# EAGLE design Čos v0.1 (EAGLE 9.6.2)
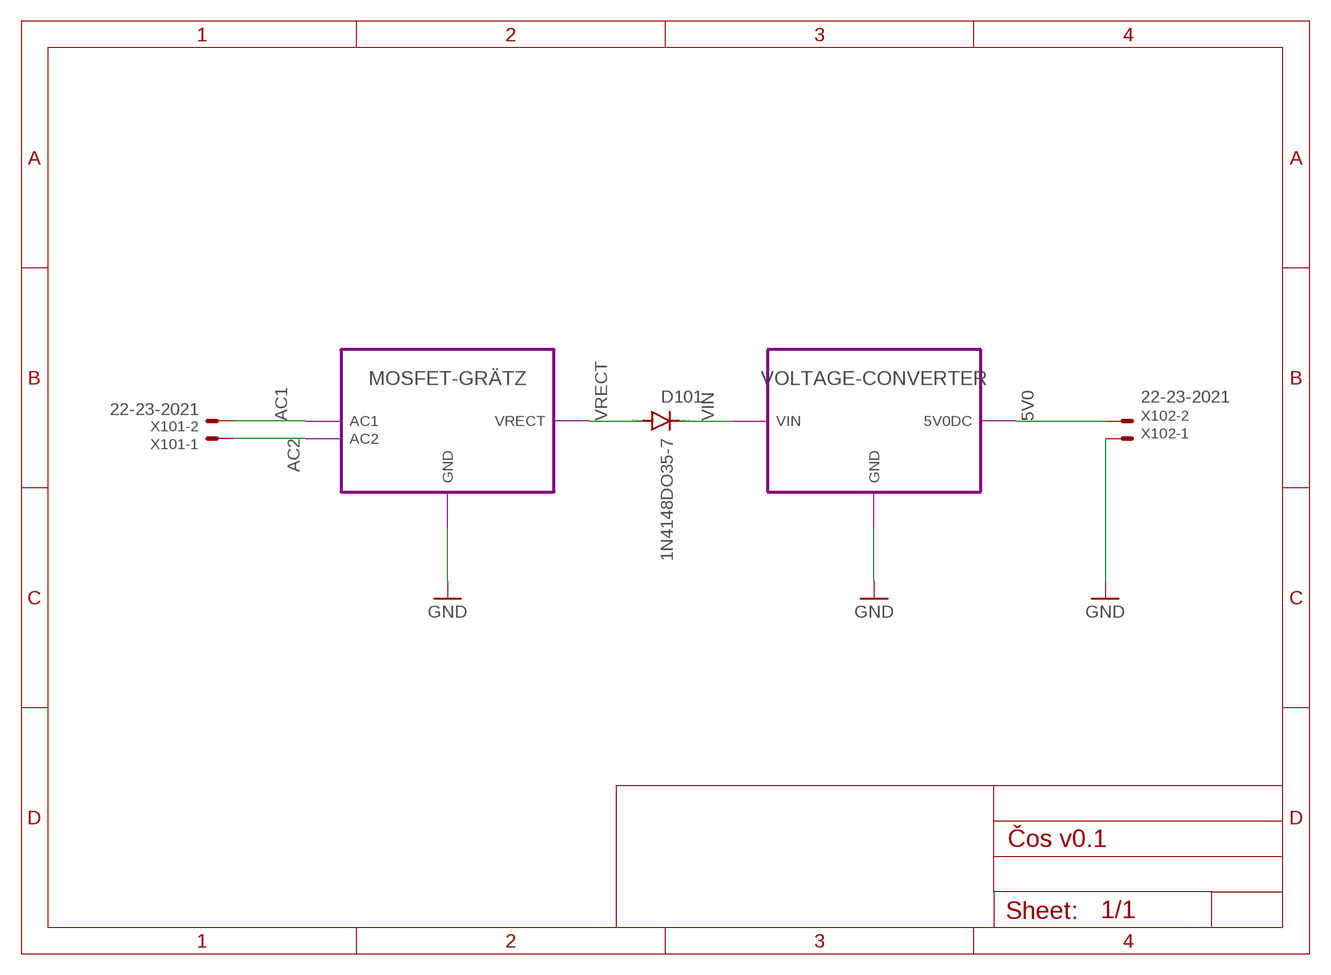
[diagram p0: schematic, sheet 1]

## Parts
D101  1N4148DO35-7  [DO35-7]
X101  22-23-2021  [22-23-2021]
X102  22-23-2021  [22-23-2021]

## Module instances
MOSFET-GRÄTZ = MOSFET-GRAETZ (part numbers offset by 200)
VOLTAGE-CONVERTER = VOLTAGE-CONVERTER (part numbers offset by 300)

## Nets
5V0 [voltage]: X102.2 ; port VOLTAGE-CONVERTER.5V0DC
AC1 [voltage]: X101.2 ; port MOSFET-GRÄTZ.AC1
AC2 [voltage]: X101.1 ; port MOSFET-GRÄTZ.AC2
GND [GND]: X102.1 ; port MOSFET-GRÄTZ.GND VOLTAGE-CONVERTER.GND
VIN [voltage]: D101.C ; port VOLTAGE-CONVERTER.VIN
VRECT [voltage]: D101.A ; port MOSFET-GRÄTZ.VRECT

## Library data of the parts
D101 = diode:1N4148: DIODE high speed (Philips)
X101 X102 = con-molex:22-23-2021: .100" (2.54mm) Center Header - 2 Pin; MF: MOLEX; MPN: 22-23-2021; OC_FARNELL: 1462926; OC_NEWARK: 25C3832

## Module MOSFET-GRAETZ
Ports: AC1(pwr) AC2(pwr) VRECT(pwr) GND(pwr)
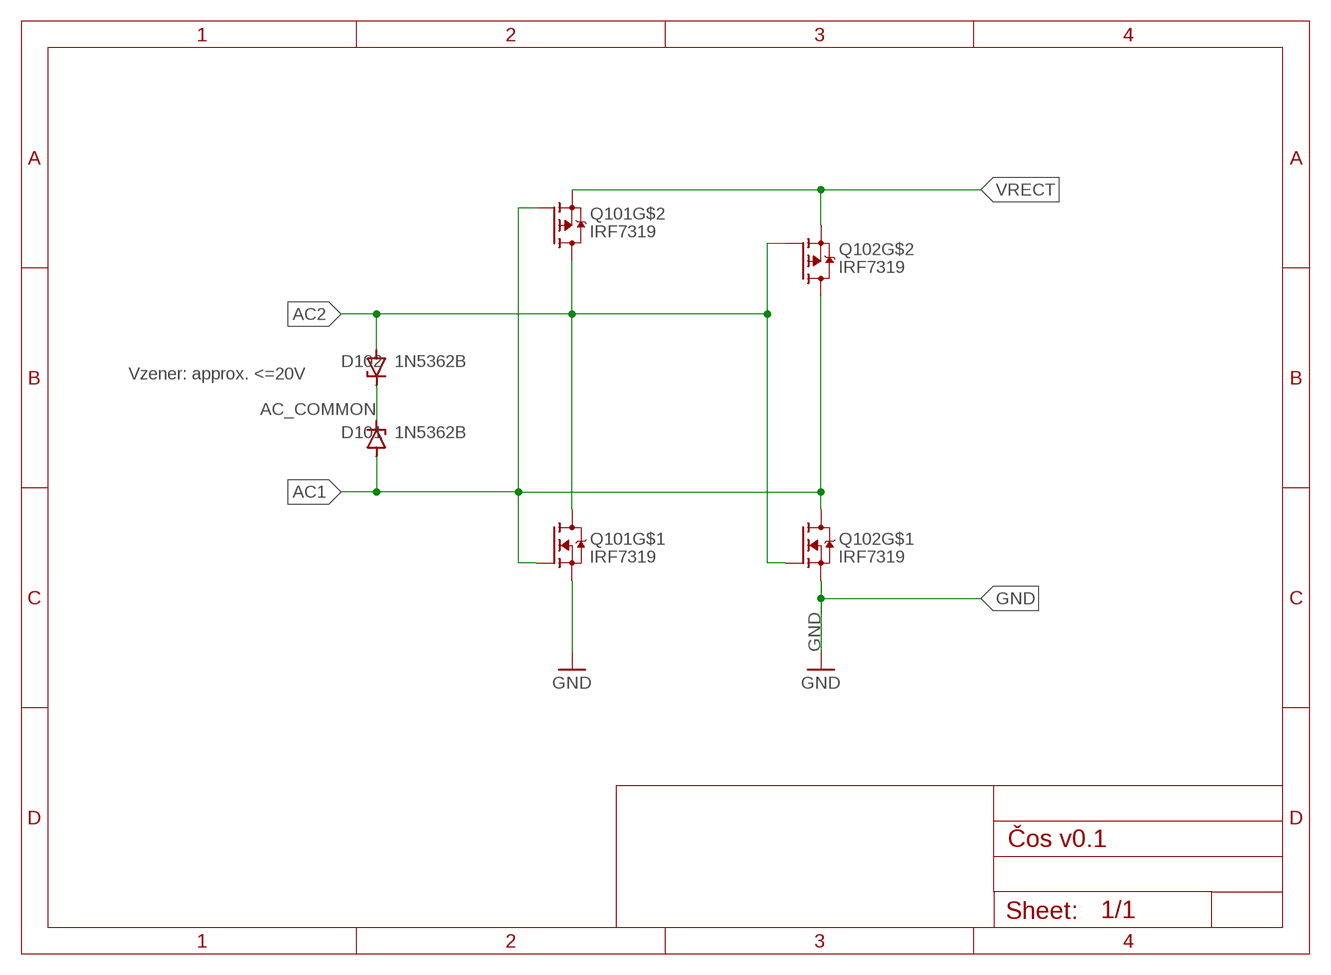
[diagram p1: schematic, module MOSFET-GRAETZ, sheet 1]

### Parts
D101  1N5362B  ZENER-DIODEDO34-7  [DO34Z7]
D102  1N5362B  ZENER-DIODEDO34-7  [DO34Z7]
Q101  IRF7319  [SOIC127P600X175-8N]
Q102  IRF7319  [SOIC127P600X175-8N]

### Nets
AC1 [voltage]: D101.A Q101.2(G1) Q101.4(G2) Q102.5(D2) Q102.6(D2) Q102.7(D1) Q102.8(D1)
AC2 [voltage]: D102.A Q101.5(D2) Q101.6(D2) Q101.7(D1) Q101.8(D1) Q102.2(G1) Q102.4(G2)
AC_COMMON [voltage]: D101.C D102.C
GND [GND]: Q101.1(S1) Q102.1(S1)
VRECT [voltage]: Q101.3(S2) Q102.3(S2)

### Notes on the sheet
- Vzener: approx. <=20V

### Library data of the parts
D101 D102 = diode:ZENER-DIODE: Z-Diode
Q101 Q102 = IRF7319:IRF7319: 30V Dual N- and P- Channel HEXFET Power MOSFET in a SO-8 package Check availability <https://pricing.snapeda.com/parts/IRF7319/Infineon%20Technologies/view-part?ref=eda>; AVAILABILITY: In Stock; DESCRIPTION: Mosfet Array N and P-Channel 30V - 2W Surface Mount 8-SO; MF: Infineon Technologies; MP: IRF7319; PACKAGE: SOIC-8 International Rectifier; PRICE: None; PURCHASE-URL: https://pricing.snapeda.com/search/part/IRF7319/?ref=eda

## Module VOLTAGE-CONVERTER
Ports: VIN(pwr) GND(pwr) 5V0DC(pwr)
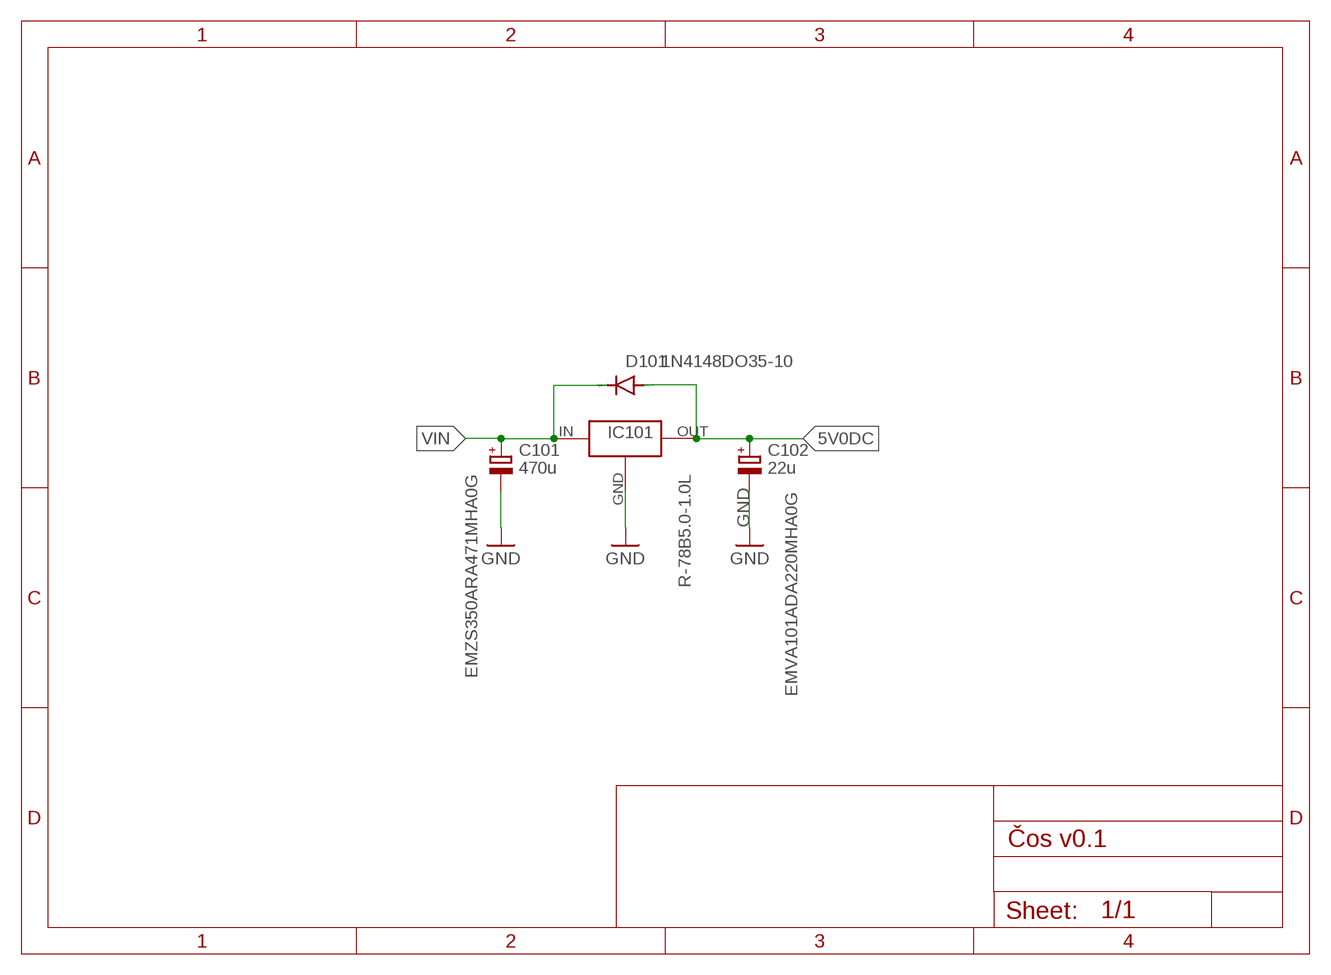
[diagram p2: schematic, module VOLTAGE-CONVERTER, sheet 1]

### Parts
C101  470u  CPOL-EU153CLV-0807  [153CLV-0807]
C102  22u  CPOL-EU153CLV-0807  [153CLV-0807]
D101  1N4148DO35-10  [DO35-10]
IC101  R-78B5.0-1.0L  R.78B5.0-1L  [TH]

### Nets
5V0DC [voltage]: C102.+ D101.A IC101.OUT
GND [GND]: C101.- C102.- IC101.GND
VIN [voltage]: C101.+ D101.C IC101.IN

### Notes on the sheet
- EMZS350ARA471MHA0G
- EMVA101ADA220MHA0G

### Library data of the parts
C101 C102 = rcl:CPOL-EU: POLARIZED CAPACITOR, European symbol; SPICEPREFIX: C
D101 = diode:1N4148: DIODE high speed (Philips)
IC101 = Recom:R.78B5.0-1L

## Net classes
1 GND: width 0.25 mm, drill 0.25 mm, clearance 0.35 mm
2 voltage: width 0.25 mm, drill 0.25 mm, clearance 0.35 mm

## Board
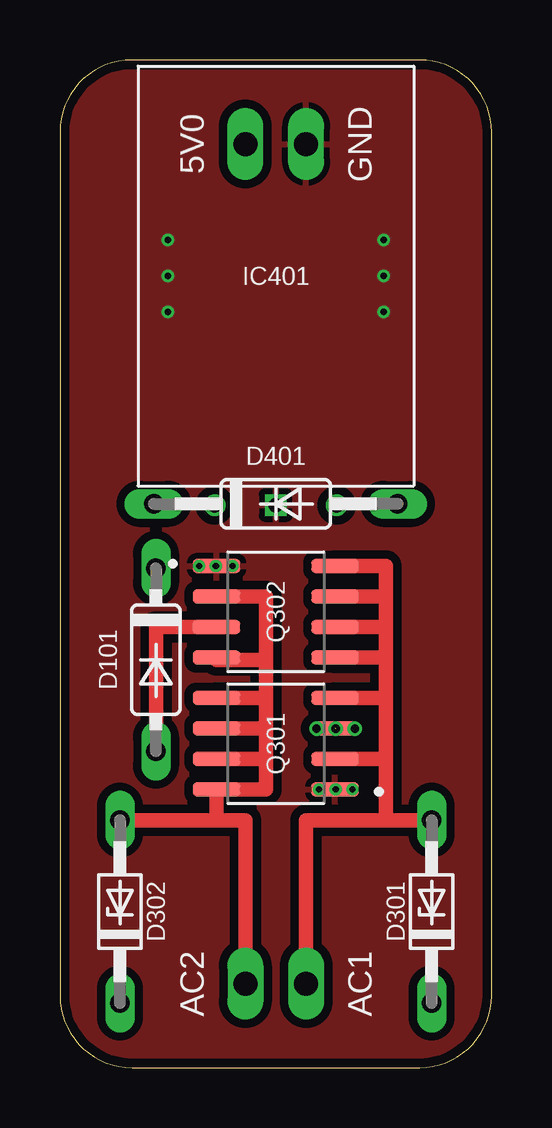
[diagram p3: board, top side]
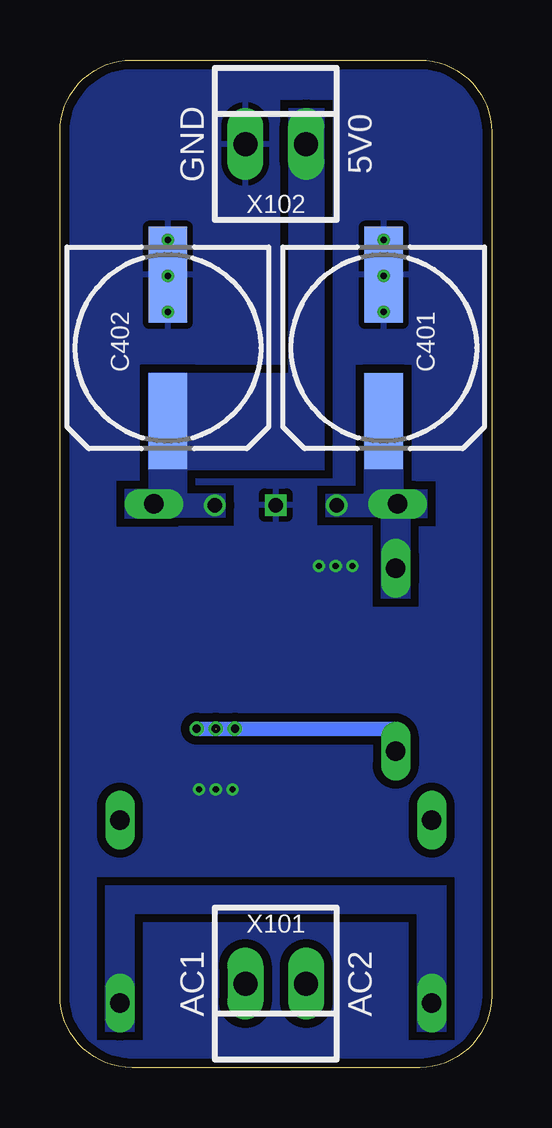
[diagram p4: board, bottom side, seen from below]

Size 18 x 42 mm. Coordinates in mm from the lower left corner, seen from the top.
Outline: 15,42 3,42 arc90 0,39 0,3 arc90 3,0 15,0 arc90 18,3 18,39 arc90 15,42
Copper layers (1*16): Top 0.035559375mm / dielectric 1.6mm / Bottom 0.035559375mm
Design rules "oshpark-2layer": minimum track width 6mil, minimum drill 10mil, track to track 6mil, track to pad 6mil, pad to pad 6mil, via to via 6mil, smd to smd 6mil, copper to edge 15mil, drill to drill 6mil, minimum pad ring 5mil, minimum via ring 5mil, stop-mask expansion 2.5mil, vias tented up to drill 0mil, thermal gap 10mil
tRestrict: area 12.5,11.3 to 13,11.9

### Footprints (pad centres in the part's own frame; a part is rotated, then mirrored left to right if it is on the bottom)
153CLV-0807 = smd 4 x 1.6: + 3.05,0; - -3.05,0
DO35-7 = drill 0.813 long: A 3.81,0; C -3.81,0
DO34Z7 = drill 0.813 long: A 3.81,0; C -3.81,0
DO35-10 = drill 0.813 long: A 5.08,0; C -5.08,0
TH = drill 0.6 square: GND 0,-9.56 | drill 0.6: IN -2.54,-9.56; OUT 2.54,-9.56
SOIC127P600X175-8N = smd 1.97 x 0.57: 1 -2.475,1.905; 2 -2.475,0.635; 3 -2.475,-0.635; 4 -2.475,-1.905; 5 2.475,-1.905; 6 2.475,-0.635; 7 2.475,0.635; 8 2.475,1.905
22-23-2021 = drill 1 long: 1 -1.27,0; 2 1.27,0

### Placement (x,y rotation side)
C401  470u  [153CLV-0807]  4.5,30 270 bottom
C402  22u  [153CLV-0807]  13.5,30 270 bottom
D101  4,17 270 top
D301  1N5362B  [DO34Z7]  15.5,6.5 90 top
D302  1N5362B  [DO34Z7]  2.5,6.5 90 top
D401  1N4148DO35-10  [DO35-10]  9,23.5 0 top
IC401  R-78B5.0-1.0L  [TH]  9,33 0 top
Q301  IRF7319  [SOIC127P600X175-8N]  9,13.5 180 top
Q302  IRF7319  [SOIC127P600X175-8N]  9,19 0 top
X101  9,3.5 180 bottom
X102  9,38.5 0 bottom

### Tracks (layer width: path | path; a pad name or v marks a point on that pad's centre or on a via)
5V0
  pour Bottom (rank 2, no thermals): 14.3,28.95 14.3,24.1 15.3,24.1 15.3,22.9 13.4,22.9 13.4,22.95 11.1,22.95 11.1,23.9 12.7,23.9 12.7,28.95
  pour Bottom (no thermals): 7,40 7,24.9 14.3,24.9 14.3,28.95 8.45,28.95 8.45,40
AC1
  Top 0.25: 11.47,15.5 Q301.4 | 13.6,19.64 13.6,19.6 | 13.6,18.36 13.6,18.3
  Top 0.61: 13.6,12.87 13.6,10.31 D301.A 10.27,10.31 X101.2 | Q302.8 13.6,20.91 13.6,19.6 13.6,18.3 13.6,17.09 | 13.6,17.09 Q302.5 | Q302.7 13.6,19.64 | Q302.6 13.6,18.36 | Q301.4 13.6,15.4 | 13.6,15.4 13.6,17.09 | Q301.2 13.6,12.87 | 13.6,12.87 13.6,15.4
AC2
  Top 0.25: 6.53,17 Q302.4 | D302.A 6.53,10.31 6.69,10.31 | 7.73,3.7 X101.1
  Top 0.61: 6.53,10.31 Q301.8 8.6,11.6 8.6,12.87 | Q302.2 8.6,19.64 8.6,17 | 8.6,17 6.53,17 | 7.73,3.7 7.73,9.27 7.73,10.31 D302.A | Q301.5 8.6,15.4 | 8.6,15.4 8.6,17 | Q301.6 8.6,14.13 | 8.6,14.13 8.6,15.4 | Q301.7 8.6,12.87 | 8.6,12.87 8.6,14.13
GND  (via drill 0.25)
  other vias: 13.5,33 13.5,31.5 13.5,34.5 4.5,33 4.5,31.5 4.5,34.5 11.5,11.6 10.8,11.6 12.2,11.6 6.5,20.9 5.8,20.9 7.2,20.9
  pour Bottom (rank 6): 0,42.5 18,42.5 18,-0.5 0,-0.5
  pour Top: -0.5,43 18.5,43 18.5,-1 -0.5,-1
MOSFET-GRÄTZ:AC_COMMON
  pour Bottom (no thermals): 1.9,7.6 1.9,1.5 3.1,1.5 3.1,6.4 14.9,6.4 14.9,1.5 16.1,1.5 16.1,7.6
VIN
  Bottom 0.25: 3.92,26.37 C401.+
  pour Bottom (rank 2, no thermals): 3.7,28.95 3.7,24.1 2.7,24.1 2.7,22.9 3.4,22.9 3.4,19.55 4.6,19.55 4.6,22.95 6.9,22.95 6.9,23.9 5.3,23.9 5.3,28.95
VRECT  (via drill 0.35)  (1 unrouted)
  Top 0.25: 10.73,14.16 v10.7,14.12
  Top 0.61: D101.A 4,18.36 Q302.3
  Bottom 0.61: D101.A 4,14.12 v10.7,14.12 v11.5,14.12 v12.3,14.12

### Text on the board
tPlace: 5V0 | GND | AC2 | AC1
bPlace: 5V0 | GND | AC2 | AC1
bStop: ejovrh | Čos v.01